# EAGLE schematic Precision Arduino Charlieplex 1.1 (EAGLE 6.2)
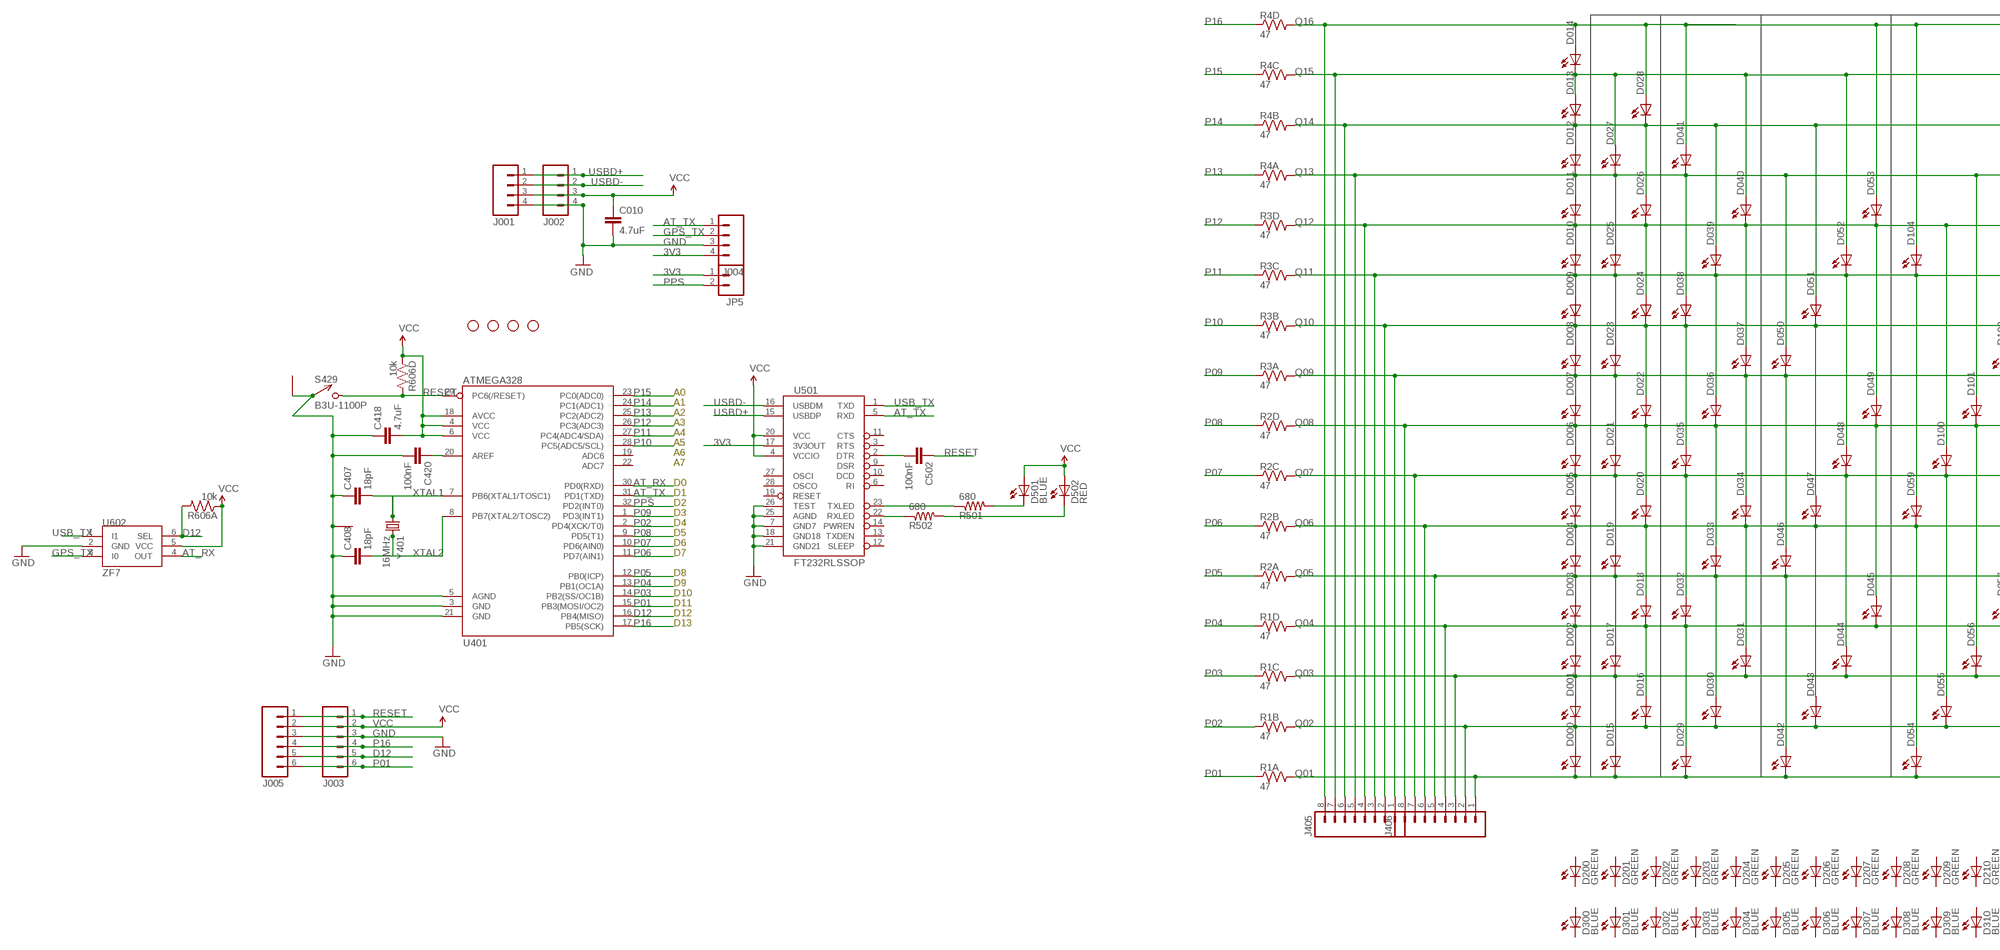
[diagram p0: schematic, sheet 1, part 1 of 2]
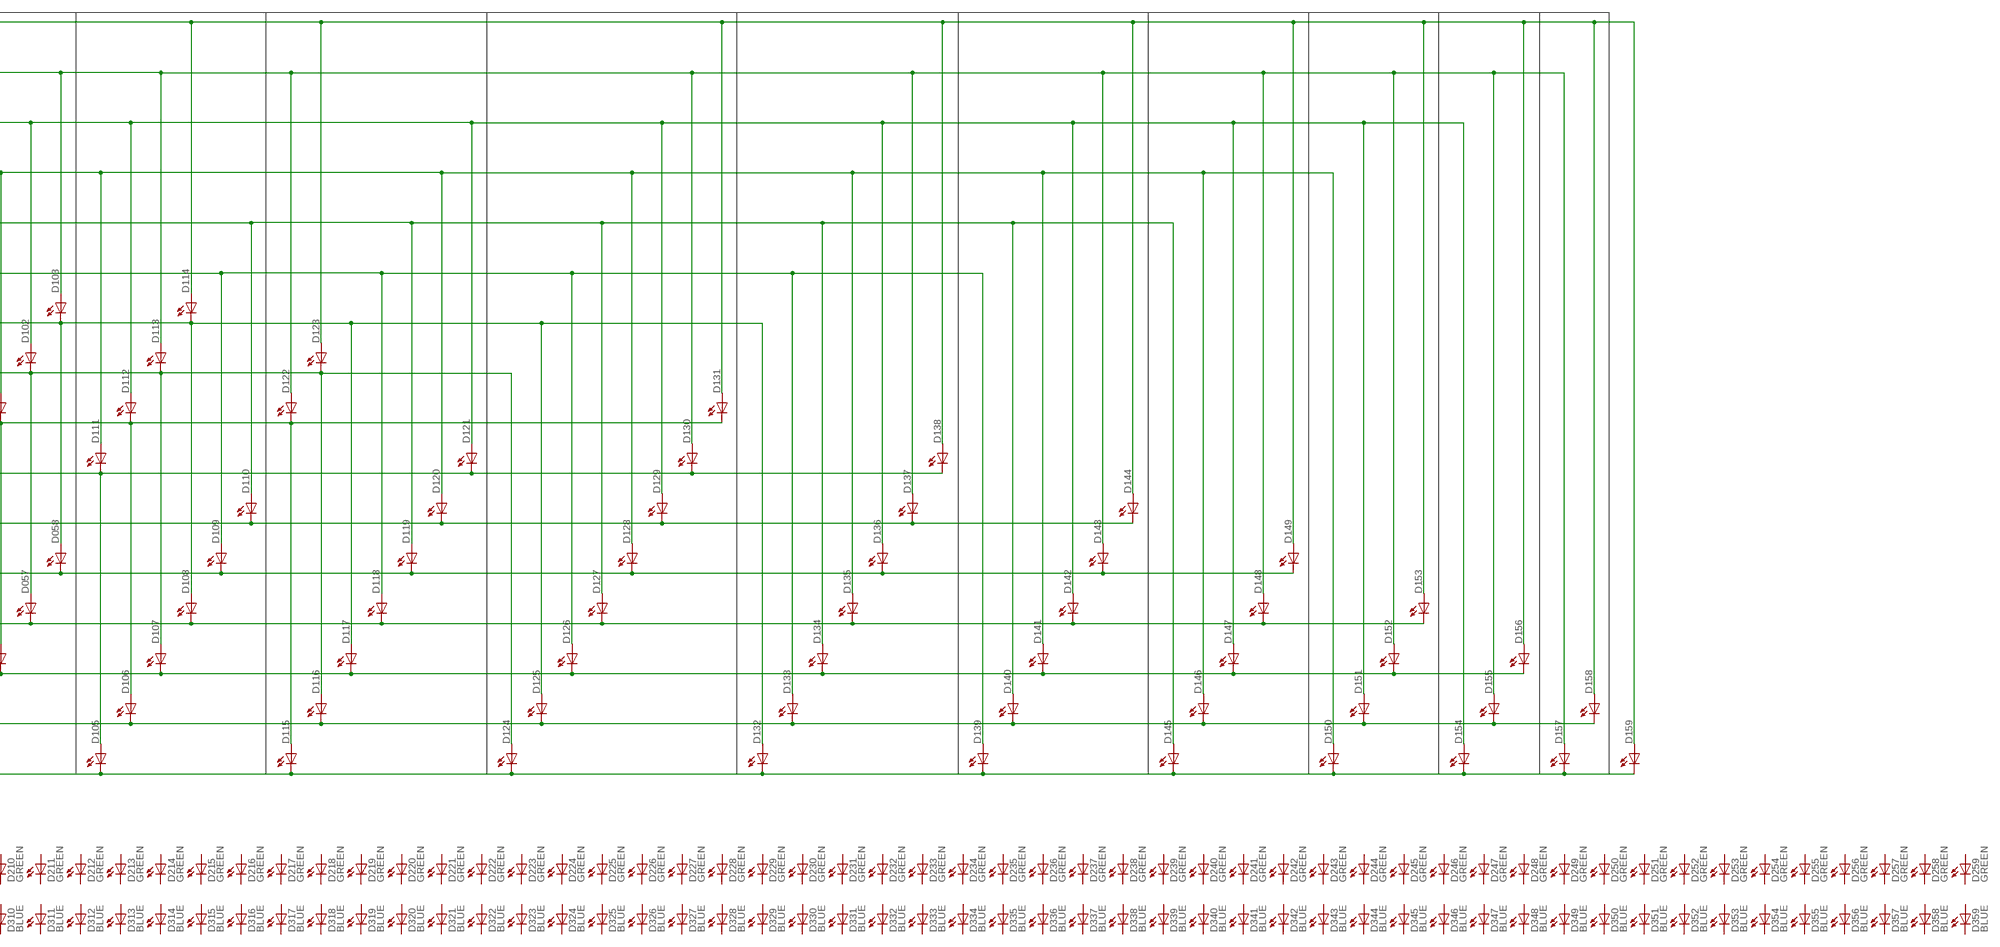
[diagram p1: schematic, sheet 1, part 2 of 2]

## Parts
C010  4.7uF  CAP0603-CAP  [0603-CAP]
C407  18pF  CAP0603-CAP  [0603-CAP]
C408  18pF  CAP0603-CAP  [0603-CAP]
C418  4.7uF  CAP0603-CAP  [0603-CAP]
C420  100nF  CAP0603-CAP  [0603-CAP]
C502  100nF  CAP0603-CAP  [0603-CAP]
D000  RED  LED0603  [LED-0603]
D001  RED  LED0603  [LED-0603]
D002  RED  LED0603  [LED-0603]
D003  RED  LED0603  [LED-0603]
D004  RED  LED0603  [LED-0603]
D005  RED  LED0603  [LED-0603]
D006  RED  LED0603  [LED-0603]
D007  RED  LED0603  [LED-0603]
D008  RED  LED0603  [LED-0603]
D009  RED  LED0603  [LED-0603]
D010  RED  LED0603  [LED-0603]
D011  RED  LED0603  [LED-0603]
D012  RED  LED0603  [LED-0603]
D013  RED  LED0603  [LED-0603]
D014  RED  LED0603  [LED-0603]
D015  RED  LED0603  [LED-0603]
D016  RED  LED0603  [LED-0603]
D017  RED  LED0603  [LED-0603]
D018  RED  LED0603  [LED-0603]
D019  RED  LED0603  [LED-0603]
D020  RED  LED0603  [LED-0603]
D021  RED  LED0603  [LED-0603]
D022  RED  LED0603  [LED-0603]
D023  RED  LED0603  [LED-0603]
D024  RED  LED0603  [LED-0603]
D025  RED  LED0603  [LED-0603]
D026  RED  LED0603  [LED-0603]
D027  RED  LED0603  [LED-0603]
D028  RED  LED0603  [LED-0603]
D029  RED  LED0603  [LED-0603]
D030  RED  LED0603  [LED-0603]
D031  RED  LED0603  [LED-0603]
D032  RED  LED0603  [LED-0603]
D033  RED  LED0603  [LED-0603]
D034  RED  LED0603  [LED-0603]
D035  RED  LED0603  [LED-0603]
D036  RED  LED0603  [LED-0603]
D037  RED  LED0603  [LED-0603]
D038  RED  LED0603  [LED-0603]
D039  RED  LED0603  [LED-0603]
D040  RED  LED0603  [LED-0603]
D041  RED  LED0603  [LED-0603]
D042  RED  LED0603  [LED-0603]
D043  RED  LED0603  [LED-0603]
D044  RED  LED0603  [LED-0603]
D045  RED  LED0603  [LED-0603]
D046  RED  LED0603  [LED-0603]
D047  RED  LED0603  [LED-0603]
D048  RED  LED0603  [LED-0603]
D049  RED  LED0603  [LED-0603]
D050  RED  LED0603  [LED-0603]
D051  RED  LED0603  [LED-0603]
D052  RED  LED0603  [LED-0603]
D053  RED  LED0603  [LED-0603]
D054  RED  LED0603  [LED-0603]
D055  RED  LED0603  [LED-0603]
D056  RED  LED0603  [LED-0603]
D057  RED  LED0603  [LED-0603]
D058  RED  LED0603  [LED-0603]
D059  RED  LED0603  [LED-0603]
D100  YELLOW  LED0603  [LED-0603]
D101  YELLOW  LED0603  [LED-0603]
D102  YELLOW  LED0603  [LED-0603]
D103  YELLOW  LED0603  [LED-0603]
D104  YELLOW  LED0603  [LED-0603]
D105  YELLOW  LED0603  [LED-0603]
D106  YELLOW  LED0603  [LED-0603]
D107  YELLOW  LED0603  [LED-0603]
D108  YELLOW  LED0603  [LED-0603]
D109  YELLOW  LED0603  [LED-0603]
D110  YELLOW  LED0603  [LED-0603]
D111  YELLOW  LED0603  [LED-0603]
D112  YELLOW  LED0603  [LED-0603]
D113  YELLOW  LED0603  [LED-0603]
D114  YELLOW  LED0603  [LED-0603]
D115  YELLOW  LED0603  [LED-0603]
D116  YELLOW  LED0603  [LED-0603]
D117  YELLOW  LED0603  [LED-0603]
D118  YELLOW  LED0603  [LED-0603]
D119  YELLOW  LED0603  [LED-0603]
D120  YELLOW  LED0603  [LED-0603]
D121  YELLOW  LED0603  [LED-0603]
D122  YELLOW  LED0603  [LED-0603]
D123  YELLOW  LED0603  [LED-0603]
D124  YELLOW  LED0603  [LED-0603]
D125  YELLOW  LED0603  [LED-0603]
D126  YELLOW  LED0603  [LED-0603]
D127  YELLOW  LED0603  [LED-0603]
D128  YELLOW  LED0603  [LED-0603]
D129  YELLOW  LED0603  [LED-0603]
D130  YELLOW  LED0603  [LED-0603]
D131  YELLOW  LED0603  [LED-0603]
D132  YELLOW  LED0603  [LED-0603]
D133  YELLOW  LED0603  [LED-0603]
D134  YELLOW  LED0603  [LED-0603]
D135  YELLOW  LED0603  [LED-0603]
D136  YELLOW  LED0603  [LED-0603]
D137  YELLOW  LED0603  [LED-0603]
D138  YELLOW  LED0603  [LED-0603]
D139  YELLOW  LED0603  [LED-0603]
D140  YELLOW  LED0603  [LED-0603]
D141  YELLOW  LED0603  [LED-0603]
D142  YELLOW  LED0603  [LED-0603]
D143  YELLOW  LED0603  [LED-0603]
D144  YELLOW  LED0603  [LED-0603]
D145  YELLOW  LED0603  [LED-0603]
D146  YELLOW  LED0603  [LED-0603]
D147  YELLOW  LED0603  [LED-0603]
D148  YELLOW  LED0603  [LED-0603]
D149  YELLOW  LED0603  [LED-0603]
D150  YELLOW  LED0603  [LED-0603]
D151  YELLOW  LED0603  [LED-0603]
D152  YELLOW  LED0603  [LED-0603]
D153  YELLOW  LED0603  [LED-0603]
D154  YELLOW  LED0603  [LED-0603]
D155  YELLOW  LED0603  [LED-0603]
D156  YELLOW  LED0603  [LED-0603]
D157  YELLOW  LED0603  [LED-0603]
D158  YELLOW  LED0603  [LED-0603]
D159  YELLOW  LED0603  [LED-0603]
D200  GREEN  LED0603  [LED-0603]
D201  GREEN  LED0603  [LED-0603]
D202  GREEN  LED0603  [LED-0603]
D203  GREEN  LED0603  [LED-0603]
D204  GREEN  LED0603  [LED-0603]
D205  GREEN  LED0603  [LED-0603]
D206  GREEN  LED0603  [LED-0603]
D207  GREEN  LED0603  [LED-0603]
D208  GREEN  LED0603  [LED-0603]
D209  GREEN  LED0603  [LED-0603]
D210  GREEN  LED0603  [LED-0603]
D211  GREEN  LED0603  [LED-0603]
D212  GREEN  LED0603  [LED-0603]
D213  GREEN  LED0603  [LED-0603]
D214  GREEN  LED0603  [LED-0603]
D215  GREEN  LED0603  [LED-0603]
D216  GREEN  LED0603  [LED-0603]
D217  GREEN  LED0603  [LED-0603]
D218  GREEN  LED0603  [LED-0603]
D219  GREEN  LED0603  [LED-0603]
D220  GREEN  LED0603  [LED-0603]
D221  GREEN  LED0603  [LED-0603]
D222  GREEN  LED0603  [LED-0603]
D223  GREEN  LED0603  [LED-0603]
D224  GREEN  LED0603  [LED-0603]
D225  GREEN  LED0603  [LED-0603]
D226  GREEN  LED0603  [LED-0603]
D227  GREEN  LED0603  [LED-0603]
D228  GREEN  LED0603  [LED-0603]
D229  GREEN  LED0603  [LED-0603]
D230  GREEN  LED0603  [LED-0603]
D231  GREEN  LED0603  [LED-0603]
D232  GREEN  LED0603  [LED-0603]
D233  GREEN  LED0603  [LED-0603]
D234  GREEN  LED0603  [LED-0603]
D235  GREEN  LED0603  [LED-0603]
D236  GREEN  LED0603  [LED-0603]
D237  GREEN  LED0603  [LED-0603]
D238  GREEN  LED0603  [LED-0603]
D239  GREEN  LED0603  [LED-0603]
D240  GREEN  LED0603  [LED-0603]
D241  GREEN  LED0603  [LED-0603]
D242  GREEN  LED0603  [LED-0603]
D243  GREEN  LED0603  [LED-0603]
D244  GREEN  LED0603  [LED-0603]
D245  GREEN  LED0603  [LED-0603]
D246  GREEN  LED0603  [LED-0603]
D247  GREEN  LED0603  [LED-0603]
D248  GREEN  LED0603  [LED-0603]
D249  GREEN  LED0603  [LED-0603]
D250  GREEN  LED0603  [LED-0603]
D251  GREEN  LED0603  [LED-0603]
D252  GREEN  LED0603  [LED-0603]
D253  GREEN  LED0603  [LED-0603]
D254  GREEN  LED0603  [LED-0603]
D255  GREEN  LED0603  [LED-0603]
D256  GREEN  LED0603  [LED-0603]
D257  GREEN  LED0603  [LED-0603]
D258  GREEN  LED0603  [LED-0603]
D259  GREEN  LED0603  [LED-0603]
D300  BLUE  LED0603  [LED-0603]
D301  BLUE  LED0603  [LED-0603]
D302  BLUE  LED0603  [LED-0603]
D303  BLUE  LED0603  [LED-0603]
D304  BLUE  LED0603  [LED-0603]
D305  BLUE  LED0603  [LED-0603]
D306  BLUE  LED0603  [LED-0603]
D307  BLUE  LED0603  [LED-0603]
D308  BLUE  LED0603  [LED-0603]
D309  BLUE  LED0603  [LED-0603]
D310  BLUE  LED0603  [LED-0603]
D311  BLUE  LED0603  [LED-0603]
D312  BLUE  LED0603  [LED-0603]
D313  BLUE  LED0603  [LED-0603]
D314  BLUE  LED0603  [LED-0603]
D315  BLUE  LED0603  [LED-0603]
D316  BLUE  LED0603  [LED-0603]
D317  BLUE  LED0603  [LED-0603]
D318  BLUE  LED0603  [LED-0603]
D319  BLUE  LED0603  [LED-0603]
D320  BLUE  LED0603  [LED-0603]
D321  BLUE  LED0603  [LED-0603]
D322  BLUE  LED0603  [LED-0603]
D323  BLUE  LED0603  [LED-0603]
D324  BLUE  LED0603  [LED-0603]
D325  BLUE  LED0603  [LED-0603]
D326  BLUE  LED0603  [LED-0603]
D327  BLUE  LED0603  [LED-0603]
D328  BLUE  LED0603  [LED-0603]
D329  BLUE  LED0603  [LED-0603]
D330  BLUE  LED0603  [LED-0603]
D331  BLUE  LED0603  [LED-0603]
D332  BLUE  LED0603  [LED-0603]
D333  BLUE  LED0603  [LED-0603]
D334  BLUE  LED0603  [LED-0603]
D335  BLUE  LED0603  [LED-0603]
D336  BLUE  LED0603  [LED-0603]
D337  BLUE  LED0603  [LED-0603]
D338  BLUE  LED0603  [LED-0603]
D339  BLUE  LED0603  [LED-0603]
D340  BLUE  LED0603  [LED-0603]
D341  BLUE  LED0603  [LED-0603]
D342  BLUE  LED0603  [LED-0603]
D343  BLUE  LED0603  [LED-0603]
D344  BLUE  LED0603  [LED-0603]
D345  BLUE  LED0603  [LED-0603]
D346  BLUE  LED0603  [LED-0603]
D347  BLUE  LED0603  [LED-0603]
D348  BLUE  LED0603  [LED-0603]
D349  BLUE  LED0603  [LED-0603]
D350  BLUE  LED0603  [LED-0603]
D351  BLUE  LED0603  [LED-0603]
D352  BLUE  LED0603  [LED-0603]
D353  BLUE  LED0603  [LED-0603]
D354  BLUE  LED0603  [LED-0603]
D355  BLUE  LED0603  [LED-0603]
D356  BLUE  LED0603  [LED-0603]
D357  BLUE  LED0603  [LED-0603]
D358  BLUE  LED0603  [LED-0603]
D359  BLUE  LED0603  [LED-0603]
D501  BLUE  LED0603  [LED-0603]
D502  RED  LED0603  [LED-0603]
J001  M04PTH  [1X04]
J002  M04PTH  [1X04]
J003  M06SIP  [1X06]
J004  M04PTH  [1X04]
J005  M06SIP  [1X06]
J405  M081X08  [1X08]
J406  M081X08  [1X08]
JP1  STAND-OFF  [STAND-OFF]
JP2  STAND-OFF  [STAND-OFF]
JP3  STAND-OFF  [STAND-OFF]
JP4  STAND-OFF  [STAND-OFF]
JP5  M02PTH  [1X02]
R1  47  RP404  [CRA04]
R2  47  RP404  [CRA04]
R3  47  RP404  [CRA04]
R4  47  RP404  [CRA04]
R501  680  RESISTOR0603-RES  [0603-RES]
R502  680  RESISTOR0603-RES  [0603-RES]
R606  10k  RP404  [CRA04]
S429  B3U-1100P  [B3U-1100P]
U401  ATMEGA328  ATMEGA168  [TQFP32-08]
U501  FT232RLSSOP  [SSOP28DB]
U602  ZF7  NC7SZ157  [SC-70-6]
Y401  16MHz  TSX-3225  [CRYSTAL_SMD]

## Nets
3V3: J004.4 JP5.1 U501.17(3V3OUT)
AREF: C420.1 U401.20(AREF)
AT_RX: U401.30(PD0(RXD)) U602.4(OUT)
AT_TX: J004.1 U401.31(PD1(TXD)) U501.5(RXD)
D12: J003.5 J005.5 R606.8 U401.16(PB4(MISO)) U602.6(SEL)
GND [power]: C010.2 C407.1 C408.1 C418.1 C420.2 J001.4 J002.4 J003.3 J004.3 J005.3 S429.P$1 S429.P$3 U401.3(GND) U401.5(AGND) U401.21(GND) U501.7(GND7) U501.18(GND18) U501.21(GND21) U501.25(AGND) U501.26(TEST) U602.2(GND) Y401.2 Y401.4
GPS_TX: J004.2 U602.3(I0)
N$3: C502.2 U501.2(DTR)
N$5: D501.C R501.2
N$6: R501.1 U501.23(TXLED)
N$7: R502.1 U501.22(RXLED)
N$8: D502.C R502.2
P01: J003.6 J005.6 R1.1 U401.15(PB3(MOSI/OC2))
P02: R1.2 U401.2(PD4(XCK/T0))
P03: R1.3 U401.14(PB2(SS/OC1B))
P04: R1.4 U401.13(PB1(OC1A))
P05: R2.1 U401.12(PB0(ICP))
P06: R2.2 U401.11(PD7(AIN1))
P07: R2.3 U401.10(PD6(AIN0))
P08: R2.4 U401.9(PD5(T1))
P09: R3.1 U401.1(PD3(INT1))
P10: R3.2 U401.28(PC5(ADC5/SCL))
P11: R3.3 U401.27(PC4(ADC4/SDA))
P12: R3.4 U401.26(PC3(ADC3))
P13: R4.1 U401.25(PC2(ADC2))
P14: R4.2 U401.24(PC1(ADC1))
P15: R4.3 U401.23(PC0(ADC0))
P16: J003.4 J005.4 R4.4 U401.17(PB5(SCK))
PPS: JP5.2 U401.32(PD2(INT0))
Q01: D000.C D015.C D029.C D042.C D054.C D105.C D115.C D124.C D132.C D139.C D145.C D150.C D154.C D157.C D159.C J406.1 R1.8
Q02: D000.A D001.C D016.C D030.C D043.C D055.C D106.C D116.C D125.C D133.C D140.C D146.C D151.C D155.C D158.C J406.2 R1.7
Q03: D001.A D002.C D015.A D017.C D031.C D044.C D056.C D107.C D117.C D126.C D134.C D141.C D147.C D152.C D156.C J406.3 R1.6
Q04: D002.A D003.C D016.A D018.C D029.A D032.C D045.C D057.C D108.C D118.C D127.C D135.C D142.C D148.C D153.C J406.4 R1.5
Q05: D003.A D004.C D017.A D019.C D030.A D033.C D042.A D046.C D058.C D109.C D119.C D128.C D136.C D143.C D149.C J406.5 R2.8
Q06: D004.A D005.C D018.A D020.C D031.A D034.C D043.A D047.C D054.A D059.C D110.C D120.C D129.C D137.C D144.C J406.6 R2.7
Q07: D005.A D006.C D019.A D021.C D032.A D035.C D044.A D048.C D055.A D100.C D105.A D111.C D121.C D130.C D138.C J406.7 R2.6
Q08: D006.A D007.C D020.A D022.C D033.A D036.C D045.A D049.C D056.A D101.C D106.A D112.C D115.A D122.C D131.C J406.8 R2.5
Q09: D007.A D008.C D021.A D023.C D034.A D037.C D046.A D050.C D057.A D102.C D107.A D113.C D116.A D123.C D124.A J405.1 R3.8
Q10: D008.A D009.C D022.A D024.C D035.A D038.C D047.A D051.C D058.A D103.C D108.A D114.C D117.A D125.A D132.A J405.2 R3.7
Q11: D009.A D010.C D023.A D025.C D036.A D039.C D048.A D052.C D059.A D104.C D109.A D118.A D126.A D133.A D139.A J405.3 R3.6
Q12: D010.A D011.C D024.A D026.C D037.A D040.C D049.A D053.C D100.A D110.A D119.A D127.A D134.A D140.A D145.A J405.4 R3.5
Q13: D011.A D012.C D025.A D027.C D038.A D041.C D050.A D101.A D111.A D120.A D128.A D135.A D141.A D146.A D150.A J405.5 R4.8
Q14: D012.A D013.C D026.A D028.C D039.A D051.A D102.A D112.A D121.A D129.A D136.A D142.A D147.A D151.A D154.A J405.6 R4.7
Q15: D013.A D014.C D027.A D040.A D052.A D103.A D113.A D122.A D130.A D137.A D143.A D148.A D152.A D155.A D157.A J405.7 R4.6
Q16: D014.A D028.A D041.A D053.A D104.A D114.A D123.A D131.A D138.A D144.A D149.A D153.A D156.A D158.A D159.A J405.8 R4.5
RESET: C502.1 J003.1 J005.1 R606.5 S429.P$2 U401.29(PC6(/RESET))
USB_TX: U501.1(TXD) U602.1(I1)
USBD+: J001.1 J002.1 U501.15(USBDP)
USBD-: J001.2 J002.2 U501.16(USBDM)
VCC [power]: C010.1 C418.2 D501.A D502.A J001.3 J002.3 J003.2 J005.2 R606.1 R606.4 U401.4(VCC) U401.6(VCC) U401.18(AVCC) U501.4(VCCIO) U501.20(VCC) U602.5(VCC)
XTAL1: C407.2 U401.7(PB6(XTAL1/TOSC1)) Y401.1
XTAL2: C408.2 U401.8(PB7(XTAL2/TOSC2)) Y401.3
Unconnected: D200.A D200.C D201.A D201.C D202.A D202.C D203.A D203.C D204.A D204.C D205.A D205.C D206.A D206.C D207.A D207.C D208.A D208.C D209.A D209.C D210.A D210.C D211.A D211.C D212.A D212.C D213.A D213.C D214.A D214.C D215.A D215.C D216.A D216.C D217.A D217.C D218.A D218.C D219.A D219.C D220.A D220.C D221.A D221.C D222.A D222.C D223.A D223.C D224.A D224.C D225.A D225.C D226.A D226.C D227.A D227.C D228.A D228.C D229.A D229.C D230.A D230.C D231.A D231.C D232.A D232.C D233.A D233.C D234.A D234.C D235.A D235.C D236.A D236.C D237.A D237.C D238.A D238.C D239.A D239.C D240.A D240.C D241.A D241.C D242.A D242.C D243.A D243.C D244.A D244.C D245.A D245.C D246.A D246.C D247.A D247.C D248.A D248.C D249.A D249.C D250.A D250.C D251.A D251.C D252.A D252.C D253.A D253.C D254.A D254.C D255.A D255.C D256.A D256.C D257.A D257.C D258.A D258.C D259.A D259.C D300.A D300.C D301.A D301.C D302.A D302.C D303.A D303.C D304.A D304.C D305.A D305.C D306.A D306.C D307.A D307.C D308.A D308.C D309.A D309.C D310.A D310.C D311.A D311.C D312.A D312.C D313.A D313.C D314.A D314.C D315.A D315.C D316.A D316.C D317.A D317.C D318.A D318.C D319.A D319.C D320.A D320.C D321.A D321.C D322.A D322.C D323.A D323.C D324.A D324.C D325.A D325.C D326.A D326.C D327.A D327.C D328.A D328.C D329.A D329.C D330.A D330.C D331.A D331.C D332.A D332.C D333.A D333.C D334.A D334.C D335.A D335.C D336.A D336.C D337.A D337.C D338.A D338.C D339.A D339.C D340.A D340.C D341.A D341.C D342.A D342.C D343.A D343.C D344.A D344.C D345.A D345.C D346.A D346.C D347.A D347.C D348.A D348.C D349.A D349.C D350.A D350.C D351.A D351.C D352.A D352.C D353.A D353.C D354.A D354.C D355.A D355.C D356.A D356.C D357.A D357.C D358.A D358.C D359.A D359.C R606.2 R606.3 R606.6 R606.7 U401.19(ADC6) U401.22(ADC7) U501.3(RTS) U501.6(RI) U501.9(DSR) U501.10(DCD) U501.11(CTS) U501.12(SLEEP) U501.13(TXDEN) U501.14(PWREN) U501.19(RESET) U501.27(OSCI) U501.28(OSCO)

## Notes on the sheet
- A0
- A1
- A2
- A3
- A4
- A5
- A6
- A7
- D0
- D1
- D2
- D3
- D4
- D5
- D6
- D7
- D8
- D9
- D10
- D11
- D12
- D13

## Library data of the parts
C010 C418 = SparkFun:CAP: Capacitor Standard 0603 ceramic capacitor, and 0.1" leaded capacitor.; DIGIKEY: 445-7483-1-ND
C407 C408 = SparkFun:CAP: Capacitor Standard 0603 ceramic capacitor, and 0.1" leaded capacitor.; DIGIKEY: 478-6025-1-ND
C420 C502 = SparkFun:CAP: Capacitor Standard 0603 ceramic capacitor, and 0.1" leaded capacitor.; DIGIKEY: 445-1316-1-ND
D000 D001-D009 D010-D059 = SparkFun-LED:LED: LEDs Standard schematic elements and footprints for 5mm, 3mm, 1206, and 0603 sized LEDs. 5mm - Spark Fun Electronics SKU : COM-00529 (and others); DIGIKEY: 754-1359-1-ND
D100-D159 = SparkFun-LED:LED: LEDs Standard schematic elements and footprints for 5mm, 3mm, 1206, and 0603 sized LEDs. 5mm - Spark Fun Electronics SKU : COM-00529 (and others); DIGIKEY: 754-1124-1-ND
D200-D259 = SparkFun-LED:LED: LEDs Standard schematic elements and footprints for 5mm, 3mm, 1206, and 0603 sized LEDs. 5mm - Spark Fun Electronics SKU : COM-00529 (and others); DIGIKEY: 350-2036-1-ND
D300-D359 = SparkFun-LED:LED: LEDs Standard schematic elements and footprints for 5mm, 3mm, 1206, and 0603 sized LEDs. 5mm - Spark Fun Electronics SKU : COM-00529 (and others); DIGIKEY: 350-2037-1-ND
D501 = SparkFun:LED: LEDs Standard schematic elements and footprints for 5mm, 3mm, 1206, and 0603 sized LEDs. 5mm - Spark Fun Electronics SKU : COM-00529 (and others); DIGIKEY: 350-2037-1-ND
D502 = SparkFun:LED: LEDs Standard schematic elements and footprints for 5mm, 3mm, 1206, and 0603 sized LEDs. 5mm - Spark Fun Electronics SKU : COM-00529 (and others); DIGIKEY: 754-1359-1-ND
J001 J002 J004 = SparkFun:M04: Header 4 Standard 4-pin 0.1" header. Use with straight break away headers (SKU : PRT-00116), right angle break away headers (PRT-00553), swiss pins (PRT-00743), machine pins (PRT-00117), and female headers (PRT-00115). Molex polarized connector foot print use with SKU : PRT-08231 with associated crimp pins and housings. 1MM SMD Version SKU: PRT-10208; DIGIKEY: $NOPART
J003 J005 = SparkFun:M06: Header 6 Standard 6-pin 0.1" header. Use with straight break away headers (SKU : PRT-00116), right angle break away headers (PRT-00553), swiss pins (PRT-00743), machine pins (PRT-00117), and female headers (PRT-00115). Molex polarized connector foot print use with SKU : PRT-08094 with associated crimp pins and housings. NOTES ON THE VARIANTS LOCK and LOCK_LONGPADS... This footprint was designed to help hold the alignment of a through-hole component (i.e. 6-pin header) while soldering it into place. You may notice that each hole has been shifted either up or down by 0.005 of an inch from it's more standard position (which is a perfectly straight line). This slight alteration caused the pins (the squares in the middle) to touch the edges of the holes. Because they are alternating, it causes a "brace" to hold the component in place. 0.005 has proven to be the perfect amount of "off-center" position when using our standard breakaway headers. Although looks a little odd when you look at the bare footprint, once you have a header in there, the alteration is very hard to notice. Also, if you push a header all the way into place, it is covered up entirely on the bottom side. This idea of altering the position of holes to aid alignment will be further integrated into the Sparkfun Library for other footprints. It can help hold any component with 3 or more connection pins.; DIGIKEY: $NOPART
J405 J406 = SparkFun:M08: Header 8 Standard 8-pin 0.1" header. Use with straight break away headers (SKU : PRT-00116), right angle break away headers (PRT-00553), swiss pins (PRT-00743), machine pins (PRT-00117), and female headers (PRT-00115).; DIGIKEY: $NOPART
JP1-JP4 = SparkFun:STAND-OFF: Stand Off This is the mechanical footprint for a #4 phillips button head screw. Use the keepout ring to avoid running the screw head into surrounding components. SKU : PRT-00447; DIGIKEY: $NOPART
JP5 = SparkFun:M02: Header 2 Standard 2-pin 0.1" header. Use with straight break away headers (SKU : PRT-00116), right angle break away headers (PRT-00553), swiss pins (PRT-00743), machine pins (PRT-00117), and female headers (PRT-00115). Molex polarized connector foot print use with SKU : PRT-08233 with associated crimp pins and housings.; DIGIKEY: $NOPART
R1-R4 = KwanSystems:RP4; DIGIKEY: CRA4S847CT-ND
R501 R502 = SparkFun:RESISTOR: Resistor Basic schematic elements and footprints for 0603, 1206, and PTH resistors.; DIGIKEY: P680GCT-ND
R606 = KwanSystems:RP4; DIGIKEY: CRA4S810KCT-ND
S429 = KwanSystems:B3U-1100P; DIGIKEY: SW1021CT-ND
U401 = SparkFun:ATMEGA168; DIGIKEY: ATMEGA328P-15AZCT-ND
U501 = SparkFun:FT232RL: USB UART FT232RL 4th Generation USB UART (USB <-> Serial) Controller. Spark Fun Electronics SKU : COM-00650; DIGIKEY: 768-1007-1-ND
U602 = KwanSystems:NC7SZ157; DIGIKEY: NC7SZ157P6XCT-ND
Y401 = KwanSystems:TSX-3225; DIGIKEY: 887-1319-1-ND

## Net classes
0 default: width 0.152 mm, drill 0.33 mm, clearance 0.152 mm
1 power: width 0.152 mm, drill 0.33 mm, clearance 0.152 mm